# EAGLE design TimerControl-NewAccel (EAGLE 9.6.2)

## Sheet 1 of 2
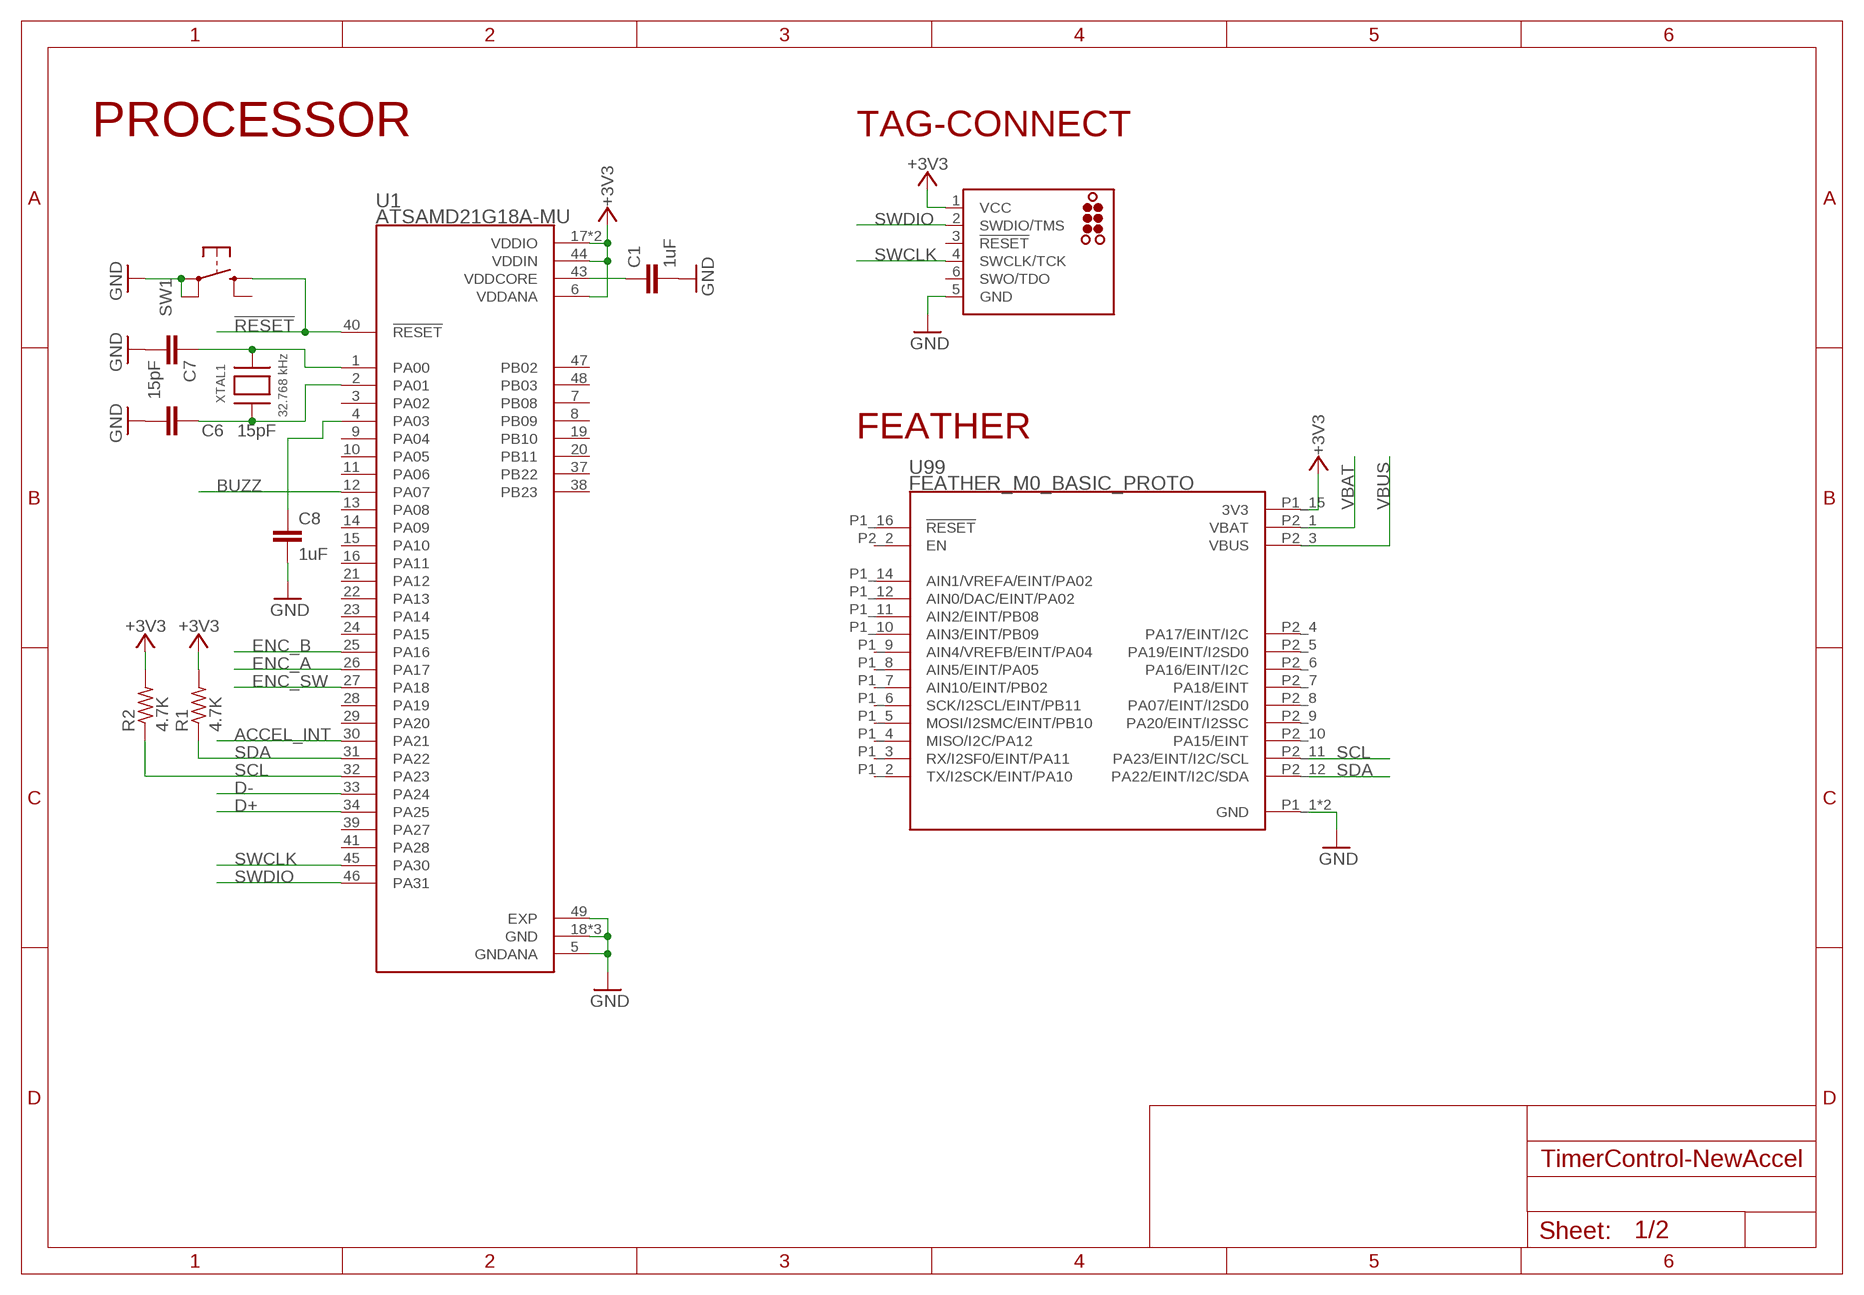
[diagram p0: schematic, sheet 1]

### Parts
C1  1uF  C-EUC0603  [C0603]
C6  15pF  C-EUC0603  [C0603]
C7  15pF  C-EUC0603  [C0603]
C8  1uF  C-EUC0603  [C0603]
J3  TC2030_SWD-MCP-NL  [TC2030-MCP-NL]
R1  4.7K  R-US_R0603  [R0603]
R2  4.7K  R-US_R0603  [R0603]
SW1  KMR2  4PIN_SMD_BUTTON  [2.80X4.60]
U1  ATSAMD21G18A-MU  [QFN50P700X700X90-49N]
U99  FEATHER_M0_BASIC_PROTO  [MODULE_FEATHER_M0_BASIC_PROTO]
XTAL1  32.768 kHz  XTAL  [XTAL3215]

### Nets
!RESET: SW1.B(S) U1.40(!RESET)
+3V3 [power]: J3.1(VCC) R1.2 R2.2 U1.6(VDDANA) U1.17(VDDIO) U1.36(VDDIO) U1.44(VDDIN) U99.P1_15(3V3) ; also sheet 2
ACCEL_INT: U1.30(PA21) ; also sheet 2
BUZZ: U1.12(PA07) ; also sheet 2
D+: U1.34(PA25) ; also sheet 2
D-: U1.33(PA24) ; also sheet 2
ENC_A: U1.26(PA17) ; also sheet 2
ENC_B: U1.25(PA16) ; also sheet 2
ENC_SW: U1.27(PA18) ; also sheet 2
GND: C1.2 C6.2 C7.2 C8.2 J3.5(GND) SW1.A'(P1) SW1.A(P) U1.5(GNDANA) U1.18(GND) U1.35(GND) U1.42(GND) U1.49(EXP) U99.P1_1(GND) U99.P1_13(GND) ; also sheet 2
N$1: C1.1 U1.43(VDDCORE)
N$3: C8.1 U1.4(PA03)
N$12: C6.1 U1.2(PA01) XTAL1.P$1
N$16: C7.1 U1.1(PA00) XTAL1.P$2
SCL: R2.1 U1.32(PA23) U99.P2_11(PA23/EINT/I2C/SCL) ; also sheet 2
SDA: R1.1 U1.31(PA22) U99.P2_12(PA22/EINT/I2C/SDA) ; also sheet 2
SWCLK: J3.4(SWCLK/TCK) U1.45(PA30)
SWDIO: J3.2(SWDIO/TMS) U1.46(PA31)
VBAT [power]: U99.P2_1(VBAT) ; also sheet 2
VBUS: U99.P2_3(VBUS) ; also sheet 2
Unconnected: J3.3(!RESET) J3.6(SWO/TDO) SW1.B'(S1) U1.3(PA02) U1.7(PB08) U1.8(PB09) U1.9(PA04) U1.10(PA05) U1.11(PA06) U1.13(PA08) U1.14(PA09) U1.15(PA10) U1.16(PA11) U1.19(PB10) U1.20(PB11) U1.21(PA12) U1.22(PA13) U1.23(PA14) U1.24(PA15) U1.28(PA19) U1.29(PA20) U1.37(PB22) U1.38(PB23) U1.39(PA27) U1.41(PA28) U1.47(PB02) U1.48(PB03) U99.P1_2(TX/I2SCK/EINT/PA10) U99.P1_3(RX/I2SF0/EINT/PA11) U99.P1_4(MISO/I2C/PA12) U99.P1_5(MOSI/I2SMC/EINT/PB10) U99.P1_6(SCK/I2SCL/EINT/PB11) U99.P1_7(AIN10/EINT/PB02) U99.P1_8(AIN5/EINT/PA05) U99.P1_9(AIN4/VREFB/EINT/PA04) U99.P1_10(AIN3/EINT/PB09) U99.P1_11(AIN2/EINT/PB08) U99.P1_12(AIN0/DAC/EINT/PA02) U99.P1_14(AIN1/VREFA/EINT/PA02) U99.P1_16(!RESET) U99.P2_2(EN) U99.P2_4(PA17/EINT/I2C) U99.P2_5(PA19/EINT/I2SD0) U99.P2_6(PA16/EINT/I2C) U99.P2_7(PA18/EINT) U99.P2_8(PA07/EINT/I2SD0) U99.P2_9(PA20/EINT/I2SSC) U99.P2_10(PA15/EINT)

### Notes on the sheet
- PROCESSOR | TAG-CONNECT
- FEATHER

## Sheet 2 of 2
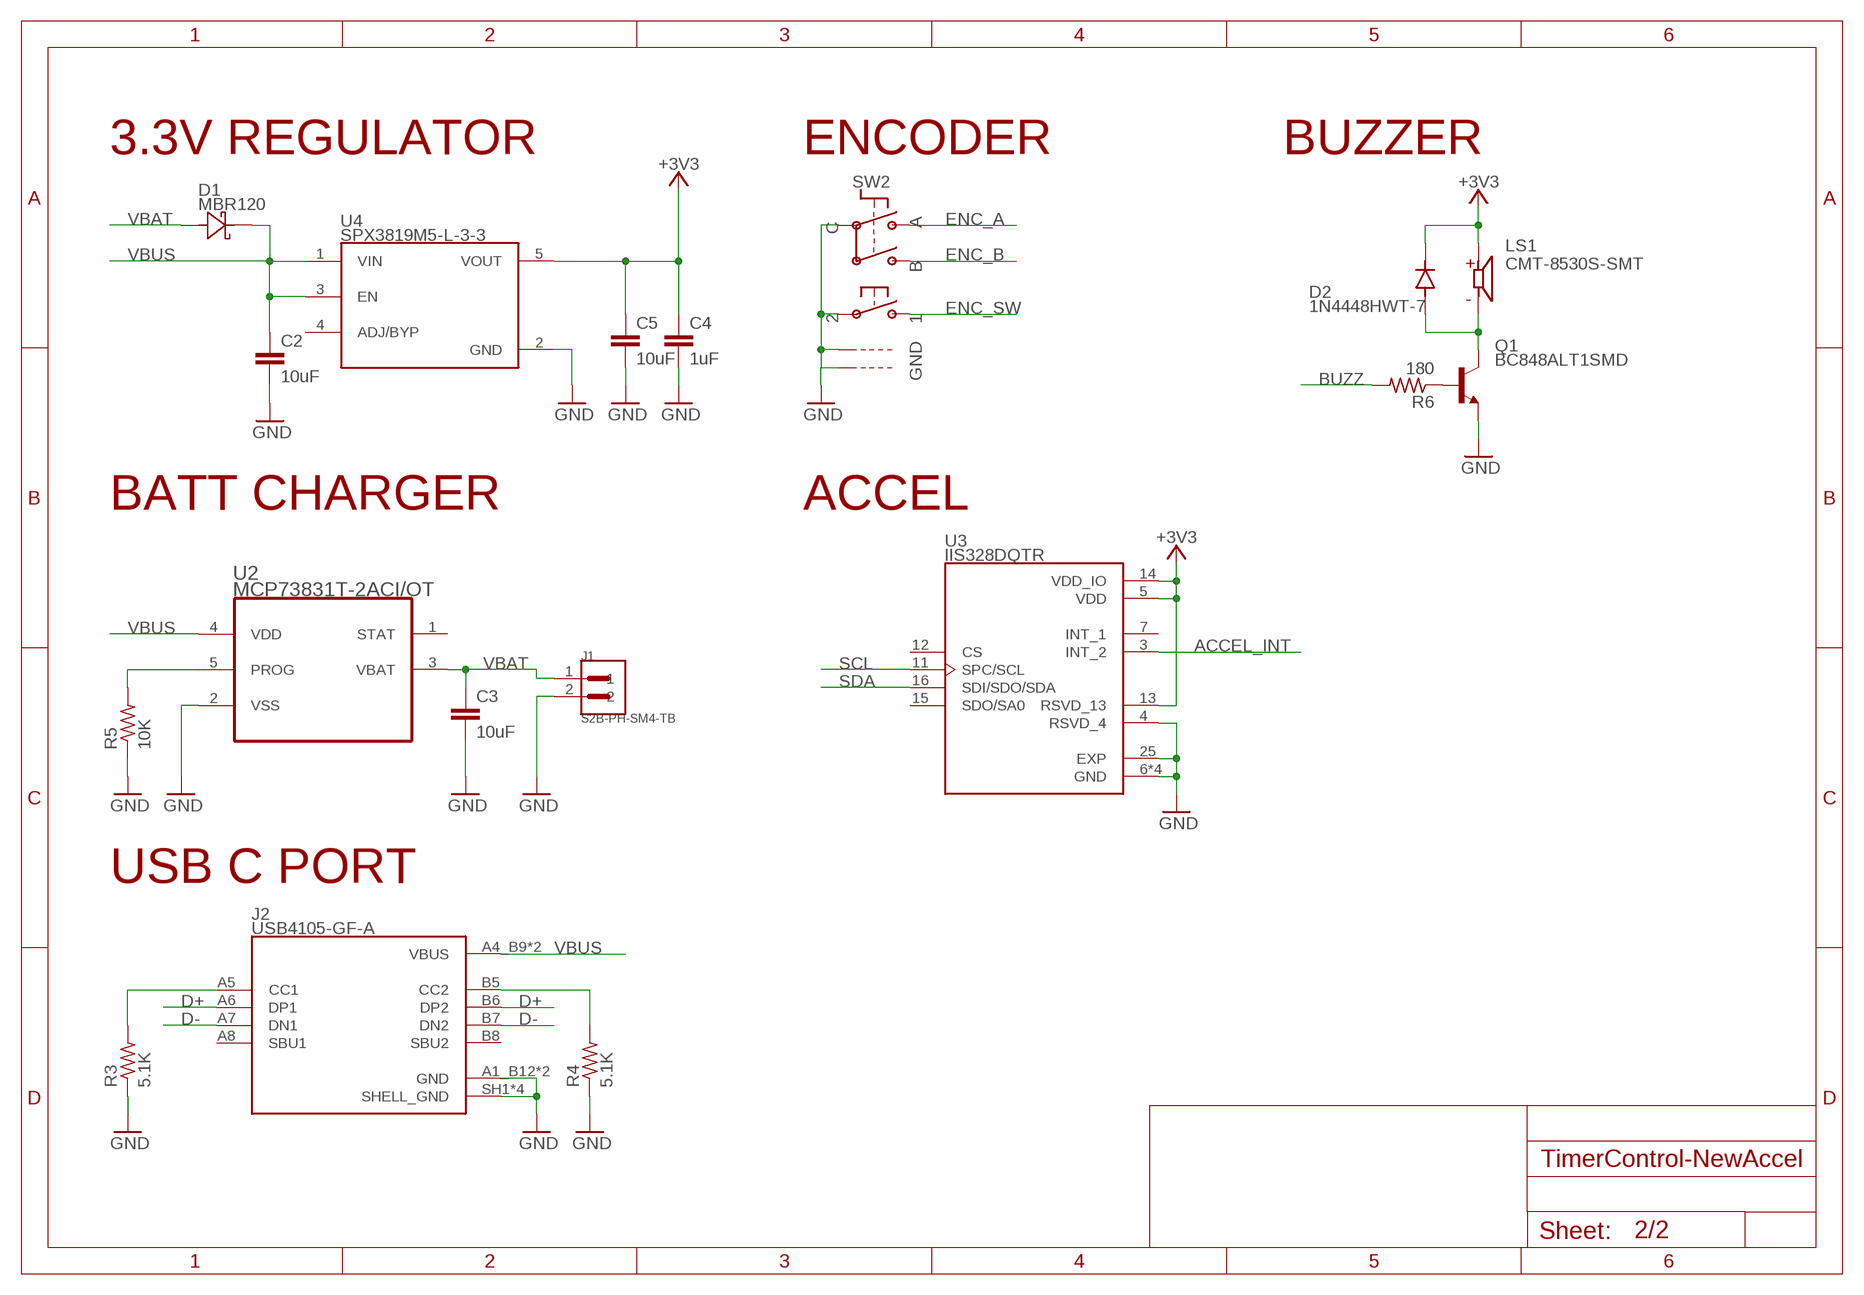
[diagram p1: schematic, sheet 2]

### Parts
C2  10uF  C-EUC0603  [C0603]
C3  10uF  C-EUC0603  [C0603]
C4  1uF  C-EUC0603  [C0603]
C5  10uF  C-EUC0603  [C0603]
D1  MBR120  [SOD−123FL]
D2  1N4448HWT-7  [SODFL1608X65N]
J1  S2B-PH-SM4-TB  [JST_S2B-PH-SM4-TB]
J2  USB4105-GF-A  [GCT_USB4105-GF-A]
LS1  CMT-8530S-SMT  [CUI_CMT-8530S-SMT]
Q1  BC848ALT1SMD  [SOT23]
R3  5.1K  R-US_R0603  [R0603]
R4  5.1K  R-US_R0603  [R0603]
R5  10K  R-US_R0603  [R0603]
R6  180  R-US_R0603  [R0603]
SW2  PEC11R_BOURNS_PEC11  [PEC11R]
U2  MCP73831T-2ACI/OT  [SOT95P280X145-5N]
U3  IIS328DQTR  [QFN50P400X400X185-25N]
U4  SPX3819M5-L-3-3  [SOT95P280X145-5N]

### Nets
+3V3 [power]: C4.1 C5.1 D2.C(K) LS1.P U3.5(VDD) U3.13(RSVD_13) U3.14(VDD_IO) U4.5(VOUT) ; also sheet 1
ACCEL_INT: U3.3(INT_2) ; also sheet 1
BUZZ: R6.2 ; also sheet 1
D+: J2.A6(DP1) J2.B6(DP2) ; also sheet 1
D-: J2.A7(DN1) J2.B7(DN2) ; also sheet 1
ENC_A: SW2.P$A ; also sheet 1
ENC_B: SW2.P$B ; also sheet 1
ENC_SW: SW2.P$1 ; also sheet 1
GND: C2.2 C3.2 C4.2 C5.2 J1.2 J2.A1_B12(GND) J2.B1_A12(GND) J2.SH1(SHELL_GND) J2.SH2(SHELL_GND) J2.SH3(SHELL_GND) J2.SH4(SHELL_GND) Q1.2(E) R3.1 R4.1 R5.1 SW2.P$2 SW2.P$C SW2.P$GND1 SW2.P$GND2 U2.2(VSS) U3.4(RSVD_4) U3.6(GND) U3.8(GND) U3.9(GND) U3.10(GND) U3.25(EXP) U4.2(GND) ; also sheet 1
N$2: R5.2 U2.5(PROG)
N$4: J2.B5(CC2) R4.2
N$5: D2.A LS1.N Q1.3(C)
N$6: Q1.1(B) R6.1
N$9: J2.A5(CC1) R3.2
SCL: U3.11(SPC/SCL) ; also sheet 1
SDA: U3.16(SDI/SDO/SDA) ; also sheet 1
VBAT [power]: C3.1 D1.A J1.1 U2.3(VBAT) ; also sheet 1
VBUS: C2.1 D1.C J2.A4_B9(VBUS) J2.B4_A9(VBUS) U2.4(VDD) U4.1(VIN) U4.3(EN) ; also sheet 1
Unconnected: J2.A8(SBU1) J2.B8(SBU2) U2.1(STAT) U3.7(INT_1) U3.12(CS) U3.15(SDO/SA0) U4.4(ADJ/BYP)

### Notes on the sheet
- 3.3V REGULATOR | ENCODER | BUZZER
- BATT CHARGER | ACCEL
- USB C PORT

## Library data of the parts
C1-C4 C6-C8 = rcl:C-EU: CAPACITOR, European symbol; SPICEPREFIX: C
C5 = rcl:C-EU: CAPACITOR, European symbol; REV: B; SPICEPREFIX: C
D1 = MBR120:MBR120
D2 = 1N4448HWT-7:1N4448HWT-7: 1N4448HWT Series 2 A 80 V 250 mW Surface Mount Fast Switching Diode - SOD-523 Check availability <https://pricing.snapeda.com/parts/1N4448HWT-7/Diodes%20Inc./view-part?ref=eda>; AVAILABILITY: In Stock; CHECK_PRICES: https://www.snapeda.com/parts/1N4448HWT-7/Diodes+Inc./view-part/?ref=eda; DESCRIPTION: Diode Switching 0.125A 80V SOD523 | Diodes Inc 1N4448HWT-7; MF: Diodes Inc.; MP: 1N4448HWT-7; PACKAGE: SOD-523 Diodes Inc.; PRICE: None; PURCHASE-URL: https://www.snapeda.com/api/url_track_click_mouser/?unipart_id=294207&manufacturer=Diodes Inc.&part_name=1N4448HWT-7&search_term=1n4448hwt-7; SNAPEDA_LINK: https://www.snapeda.com/parts/1N4448HWT-7/Diodes+Inc./view-part/?ref=snap
J1 = S2B-PH-SM4-TB:S2B-PH-SM4-TB: CONN HEADER PH SIDE 2POS 2MM SMD; MANUFACTURER: JST
J2 = USB4105-GF-A:USB4105-GF-A; MANUFACTURER: Global Connector Technology; MAXIMUM_PACKAGE_HEIGHT: 3.31mm; PARTREV: B3; STANDARD: Manufacturer Recommendations
J3 = Tag-Connect:TC2030_SWD: ARM20-CTX 20-Pin to TC2030-IDC Adapter for Cortex 6-Pin (TC2030-IDC family) </catalog/6> Cortex SWD </catalog/9> Adapters </adaptors> <javascript:void(0);> The Tag-Connect ARM20-CTX adapter board allows our TC2030-IDC cables to be used for ARM SWD (Single Wire Debug) applications. Although intended for use with our patented TC2030-IDC (and TC2030-IDC-NL) Plug-of-Nails™ Cables, the adapter may be useful to people wishing to use 6-pin 0.1” ribbon headers on their PCB instead of the traditional 20-Pin header. Please note the TC2030-IDC <http://tag-connect.com/TC2030-IDC> or TC2030-IDC-NL <http://tag-connect.com/TC2030-IDC-NL> cable is purchased separately, the cables and Segger JLINK seen in the pictures are not included! Download the Datasheet here. <http://www.tag-connect.com/Materials/ARM20-CTX.pdf>
LS1 = CMT-8530S-SMT:CMT-8530S-SMT: 8.5 mm, 3.6 Vo-p, 90 dB, Surface Mount (SMT), Magnetic Audio Transducer Buzzer; AVAILABILITY: Unavailable; DESCRIPTION: 8.5 mm, 3.6 Vo-p, 90 dB, Surface Mount _SMT_, Magnetic Audio Transducer Buzzer; MF: CUI; MP: CMT-8530S-SMT; PACKAGE: None; PRICE: None
Q1 = transistor-npn:BC848*: NPN Transistor
R1-R6 = rcl:R-US_: RESISTOR, American symbol; SPICEPREFIX: R
SW1 = SMD Button:4PIN_SMD_BUTTON
SW2 = PEC11R:PEC11R: Rotary Encoder with Built-In Switch PEC11 - 24 Step, PEC11-4215F-S24 - http://www.adafruit.com/products/377
U1 = ATSAMD21G18A-MU:ATSAMD21G18A-MU: Cortex-M0+, 256KB FLASH, 32KB SRAM, USB, DMA, T&R - 48QFN IND TEMP, GREEN, 1.6-3.6V, 48MHz/ QFN (ZA) Check availability <https://pricing.snapeda.com/parts/ATSAMD21G18A-MU/Microchip/view-part?ref=eda>; AVAILABILITY: In Stock; CHECK_PRICES: https://www.snapeda.com/parts/ATSAMD21G18A-MU/Microchip/view-part/?ref=eda; DESCRIPTION: ARM® Cortex®-M0+ SAM D21G, Functional Safety (FuSa) Microcontroller IC 32-Bit Single-Core 48MHz 256KB (256K x 8) FLASH 48-QFN (7x7); MF: Microchip; MP: ATSAMD21G18A-MU; PACKAGE: QFN-48 Microchip; PRICE: None; PURCHASE-URL: https://www.snapeda.com/api/url_track_click_mouser/?unipart_id=590181&manufacturer=Microchip&part_name=ATSAMD21G18A-MU&search_term=atsamd21g18a; SNAPEDA_LINK: https://www.snapeda.com/parts/ATSAMD21G18A-MU/Microchip/view-part/?ref=snap
U2 = MCP73831T-2ACI_OT:MCP73831T-2ACI/OT: Charge Management Controller; CHECK_PRICES: https://www.snapeda.com/parts/MCP73831T-2ACI/OT/Microchip/view-part/?ref=eda; DESCRIPTION: TINY INTEGRATED LI-ION/LI-POLY CHARGE MGNT CONTROLLER, 4.2V VREG | Microchip Technology Inc. MCP73831T-2ACI/OT; DIGIKEY_PART_NUMBER: MCP73831T-2ACI/OTTR-ND; MF: Microchip; MP: MCP73831T-2ACI/OT; PACKAGE: SOT-23 Microchip; PURCHASE-URL: https://www.snapeda.com/api/url_track_click_mouser/?unipart_id=53208&manufacturer=Microchip&part_name=MCP73831T-2ACI/OT&search_term=mcp73831; SNAPEDA_LINK: https://www.snapeda.com/parts/MCP73831T-2ACI/OT/Microchip/view-part/?ref=snap
U3 = IIS328DQTR:IIS328DQTR: Accelerometer Triple ±2g/±4g/±8g 3.3V 24-Pin QFN EP Tray; A_MAX: 1.85; B_MAX: 0.3; B_MIN: 0.2; B_NOM: 0.25; D2_NOM: 2.3; D_MAX: 4.0; D_MIN: 4.0; D_NOM: 4.0; E2_NOM: 2.3; ENOM: 0.5; E_MAX: 4.0; E_MIN: 4.0; E_NOM: 4.0; L_MAX: 0.45; L_MIN: 0.35; L_NOM: 0.4; MANUFACTURER: ST Microelectronics; MAXIMUM_PACKAGE_HEIGHT: 1.85mm; PARTREV: 3; PIN_COUNT_D: 6.0; PIN_COUNT_E: 6.0; STANDARD: IPC 7351B
U4 = SPX3819M5-L-3-3:SPX3819M5-L-3-3: 500mA, LOW-NOISE LDO VOLTAGE REGULATOR Check availability <https://pricing.snapeda.com/parts/SPX3819M5-L-3-3/MaxLinear/view-part?ref=eda>; AVAILABILITY: In Stock; DESCRIPTION: Linear Voltage Regulator IC Positive Fixed 1 Output 500mA SOT-23-5; MF: MaxLinear; MP: SPX3819M5-L-3-3; PACKAGE: SOT-23-5 MaxLinear; PRICE: None; PURCHASE-URL: https://pricing.snapeda.com/search/part/SPX3819M5-L-3-3/?ref=eda
U99 = FEATHER_M0_BASIC_PROTO:FEATHER_M0_BASIC_PROTO: ATSAMD21G18 Feather M0 Basic Proto SAM D ARM® Cortex®-M0+ MCU 32-Bit Embedded Evaluation Board Check availability <https://pricing.snapeda.com/parts/Feather%20M0%20Basic%20Proto/Adafruit%20Industries/view-part?ref=eda>; AVAILABILITY: Not in stock; CHECK_PRICES: https://www.snapeda.com/parts/Feather%20M0%20Basic%20Proto/Adafruit+Industries/view-part/?ref=eda; DESCRIPTION: ATSAMD21G18 Feather M0 Basic Proto series ARM® Cortex®-M0+ MCU 32-Bit Embedded Evaluation Board; MF: Adafruit Industries; MP: Feather M0 Basic Proto; PACKAGE: None; PRICE: None; SNAPEDA_LINK: https://www.snapeda.com/parts/Feather%20M0%20Basic%20Proto/Adafruit+Industries/view-part/?ref=snap
XTAL1 = XTAL:XTAL

## Net classes
1 power: width 0.102 mm

## Board
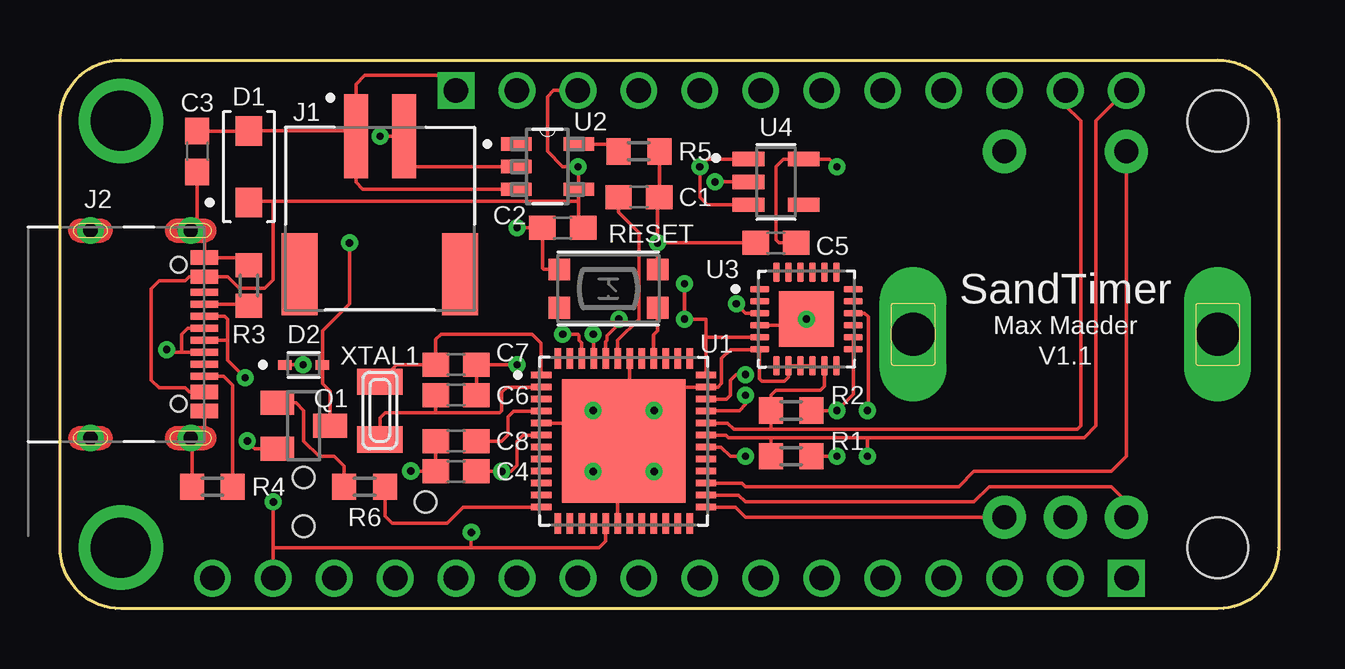
[diagram p2: board, top side]
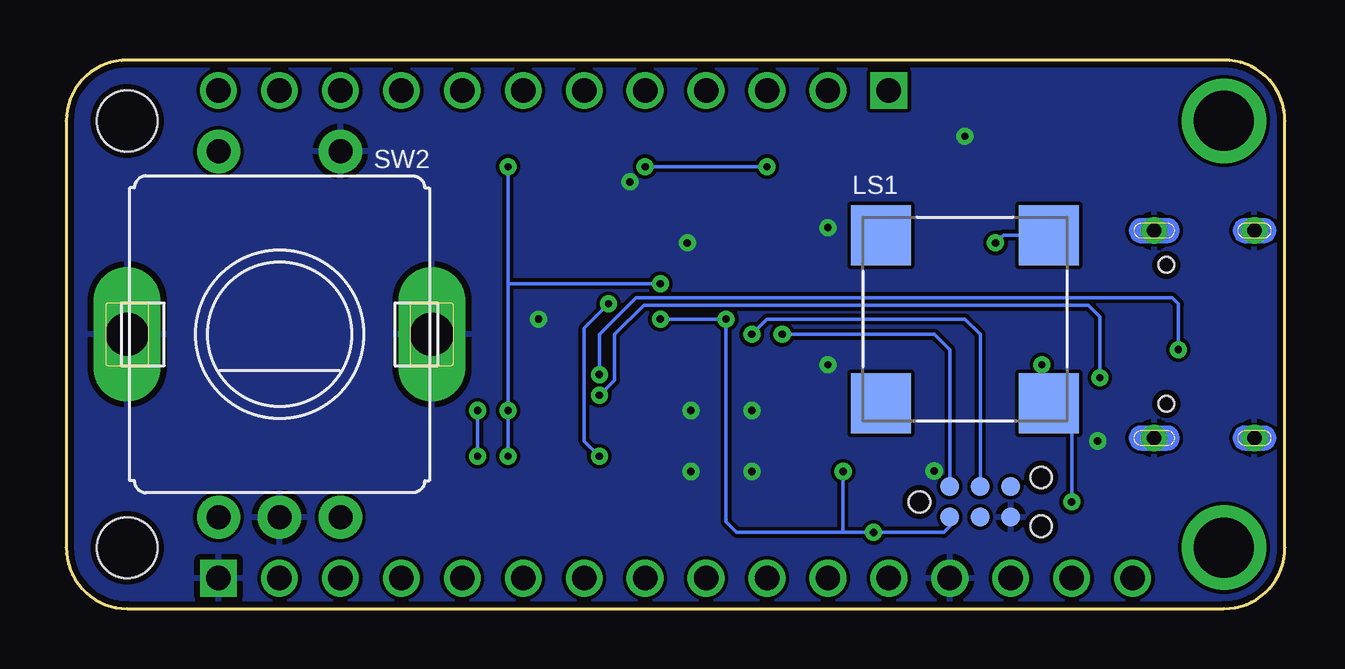
[diagram p3: board, bottom side, seen from below]

Size 50.8 x 22.86 mm. Coordinates in mm from the lower left corner, seen from the top.
Copper layers (1*16): Top 0.035mm / dielectric 1.5mm / Bottom 0.035mm
Design rules "default *": minimum track width 6mil, minimum drill 12mil, track to track 6mil, track to pad 6mil, pad to pad 6mil, via to via 6mil, smd to smd 6mil, copper to edge 10mil, drill to drill 6mil, minimum pad ring 10mil, minimum via ring 8mil, stop-mask expansion 2mil, vias tented up to drill 20mil, thermal gap 10mil

### Footprints (pad centres in the part's own frame; a part is rotated, then mirrored left to right if it is on the bottom)
C0603 = smd 1.1 x 1: 1 -0.85,0; 2 0.85,0
SOD−123FL = smd 1.24 x 1.12: A 1.49,0; C -1.49,0
SODFL1608X65N = smd 0.56 x 0.4: A 0.785,0; C -0.785,0
JST_S2B-PH-SM4-TB = smd 1 x 3.5: 1 1,0; 2 -1,0 | smd 1.5 x 3.4: P1 3.35,5.75; P2 -3.35,5.75
GCT_USB4105-GF-A = smd 0.6 x 1.15: A1_B12 -3.2,4.755; A4_B9 -2.4,4.755; B1_A12 3.2,4.755; B4_A9 2.4,4.755 | smd 0.3 x 1.15: A5 -1.25,4.755; A6 -0.25,4.755; A7 0.25,4.755; A8 1.25,4.755; B5 1.75,4.755; B6 0.75,4.755; B7 -0.75,4.755; B8 -1.75,4.755 | drill 0.6 pad 1: SH1 -4.32,4.18; SH2 4.32,4.18; SH3 -4.32,0; SH4 4.32,0 | hole 0.65: 2.89,3.68; -2.89,3.68
TC2030-MCP-NL = smd 0.787 x 0.787: 1 1.27,-0.635; 2 1.27,0.635; 3 2.54,-0.635; 4 2.54,0.635; 5 3.81,-0.635; 6 3.81,0.635 | hole 0.889: 0,0; 5.08,-1.016; 5.08,1.016
CUI_CMT-8530S-SMT = smd 2.5 x 2.5: 1 -3.5,3.5; 2 -3.5,-3.5; N 3.5,3.5; P 3.5,-3.5
SOT23 = smd 1 x 1.4: 1 -0.95,-1.1; 2 0.95,-1.1; 3 0,1.1
R0603 = smd 1 x 1.1: 1 -0.85,0; 2 0.85,0
2.80X4.60 = smd 0.9 x 0.9: A 2.05,0.8; A' -2.05,0.8; B 2.05,-0.8; B' -2.05,-0.8
PEC11R = drill 1 pad 1.8: P$1 -2.54,7.62; P$2 2.54,7.62; P$A -2.54,-7.62; P$B 2.54,-7.62; P$C 0,-7.62 | drill 1.8 pad 2.8 long: P$GND1 -6.35,0; P$GND2 6.35,0
QFN50P700X700X90-49N = smd 0.84 x 0.26: 1 -3.435,2.75; 2 -3.435,2.25; 3 -3.435,1.75; 4 -3.435,1.25; 5 -3.435,0.75; 6 -3.435,0.25; 7 -3.435,-0.25; 8 -3.435,-0.75; 9 -3.435,-1.25; 10 -3.435,-1.75; 11 -3.435,-2.25; 12 -3.435,-2.75; 25 3.435,-2.75; 26 3.435,-2.25; 27 3.435,-1.75; 28 3.435,-1.25; 29 3.435,-0.75; 30 3.435,-0.25; 31 3.435,0.25; 32 3.435,0.75; 33 3.435,1.25; 34 3.435,1.75; 35 3.435,2.25; 36 3.435,2.75 | smd 0.26 x 0.84: 13 -2.75,-3.435; 14 -2.25,-3.435; 15 -1.75,-3.435; 16 -1.25,-3.435; 17 -0.75,-3.435; 18 -0.25,-3.435; 19 0.25,-3.435; 20 0.75,-3.435; 21 1.25,-3.435; 22 1.75,-3.435; 23 2.25,-3.435; 24 2.75,-3.435; 37 2.75,3.435; 38 2.25,3.435; 39 1.75,3.435; 40 1.25,3.435; 41 0.75,3.435; 42 0.25,3.435; 43 -0.25,3.435; 44 -0.75,3.435; 45 -1.25,3.435; 46 -1.75,3.435; 47 -2.25,3.435; 48 -2.75,3.435 | smd 5.15 x 5.15: 49 0,0
SOT95P280X145-5N = smd 1.27 x 0.559: 1 -1.295,0.94; 2 -1.295,0; 3 -1.295,-0.94; 4 1.295,-0.94; 5 1.295,0.94
QFN50P400X400X185-25N = smd 0.81 x 0.27: 1 -1.95,1.25; 2 -1.95,0.75; 3 -1.95,0.25; 4 -1.95,-0.25; 5 -1.95,-0.75; 6 -1.95,-1.25; 13 1.95,-1.25; 14 1.95,-0.75; 15 1.95,-0.25; 16 1.95,0.25; 17 1.95,0.75; 18 1.95,1.25 | smd 0.27 x 0.81: 7 -1.25,-1.95; 8 -0.75,-1.95; 9 -0.25,-1.95; 10 0.25,-1.95; 11 0.75,-1.95; 12 1.25,-1.95; 19 1.25,1.95; 20 0.75,1.95; 21 0.25,1.95; 22 -0.25,1.95; 23 -0.75,1.95; 24 -1.25,1.95 | smd 2.3 x 2.3: 25 0,0
SOT95P280X145-5N' = smd 1.32 x 0.6: 1 -1.15,0.95; 2 -1.15,0; 3 -1.15,-0.95; 4 1.15,-0.95; 5 1.15,0.95
MODULE_FEATHER_M0_BASIC_PROTO = drill 1.02 square: P1_1 19.05,-10.16; P2_1 -8.89,10.16 | drill 1.02: P1_2 16.51,-10.16; P1_3 13.97,-10.16; P1_4 11.43,-10.16; P1_5 8.89,-10.16; P1_6 6.35,-10.16; P1_7 3.81,-10.16; P1_8 1.27,-10.16; P1_9 -1.27,-10.16; P1_10 -3.81,-10.16; P1_11 -6.35,-10.16; P1_12 -8.89,-10.16; P1_13 -11.43,-10.16; P1_14 -13.97,-10.16; P1_15 -16.51,-10.16; P1_16 -19.05,-10.16; P2_2 -6.35,10.16; P2_3 -3.81,10.16; P2_4 -1.27,10.16; P2_5 1.27,10.16; P2_6 3.81,10.16; P2_7 6.35,10.16; P2_8 8.89,10.16; P2_9 11.43,10.16; P2_10 13.97,10.16; P2_11 16.51,10.16; P2_12 19.05,10.16 | drill 2.5 pad 3.2: P$1 -22.86,8.89; P$2 -22.86,-8.89 | hole 2.54: 22.86,-8.89; 22.86,8.89
XTAL3215 = smd 1.1 x 1.9: P$1 1.2,0; P$2 -1.2,0

### Placement (x,y rotation side)
C1  24.13,17.14 0 top
C2  20.95,15.88 180 top
C3  5.71,19.05 270 top
C4  16.51,5.71 180 top
C5  29.84,15.24 180 top
C6  16.51,8.89 0 top
C7  16.51,10.16 0 top
C8  16.51,6.99 180 top
D1  7.87,18.41 90 top
D2  10.16,10.16 0 top
J1  13.34,19.68 180 top
J2  1.27,11.43 270 top
J3  15.24,4.45 0 bottom
LS1  13.34,12.06 0 bottom
Q1  10.16,7.62 270 top
R1  30.48,6.35 0 top
R2  30.48,8.26 0 top
R3  7.87,13.46 270 top
R4  6.35,5.08 0 top
R5  24.13,19.05 180 top
R6  12.7,5.08 0 top
SW1  22.86,13.34 0 top
SW2  41.91,11.43 0 bottom
U1  23.5,6.99 0 top
U2  20.32,18.41 0 top
U3  31.11,12.06 0 top
U4  SPX3819M5-L-3-3  [SOT95P280X145-5N']  29.84,17.78 0 top
U99  25.4,11.43 0 top
XTAL1  13.34,8.26 270 top

### Tracks (layer width: path | path; a pad name or v marks a point on that pad's centre or on a via)
!RESET
  Top 0.152: U1.40 24.75,11.41 24.91,11.57 SW1.B
+3V3  (via drill 0.3)
  Top 0.152: 26.93,11.31 26.93,12.06 v26.04,12.06 v26.04,13.54 | 26.93,11.31 U1.36 | U1.6 19.3,7.24 19.05,6.99 19.05,5.97 18.8,5.71 v18.41,5.71 C4.1 | U1.17 22.75,2.81 22.48,2.54 17.14,2.54 | U99.P1_15 8.89,2.54 | 17.14,2.54 v17.14,3.17 | U1.44 22.75,11.12 22.81,11.19 22.81,11.38 23.3,11.87 v23.3,12.06 | C5.1 29.97,15.24 29.84,15.37 29.84,18.41 30.16,18.73 U4.5 32.07,18.73 v32.38,18.41 | R1.2 v32.38,6.35 | R2.2 v32.38,8.26 33.06,8.94 U3.13 U3.14 | D2.C v10.13,10.16 | 8.89,2.54 v8.89,4.45 | 17.14,2.54 8.89,2.54 | U3.5 26.93,11.31
  Bottom 0.152: J3.1 13.97,3.43 14.22,3.17 v17.14,3.17 18.41,3.17 | 18.41,3.17 22.86,3.17 23.3,3.61 v23.3,12.06 v26.04,12.06 | v32.38,6.35 v32.38,8.26 32.38,13.54 | v32.38,18.41 32.38,13.56 32.38,13.54 | v10.13,10.16 10.13,8.86 9.84,8.57 | 9.84,8.57 LS1.P | 18.41,3.17 v18.41,5.71 | v8.89,4.45 8.89,8.57 9.84,8.57 | v26.04,13.54 32.38,13.54
ACCEL_INT  (via drill 0.3)
  Top 0.152: U1.30 27.55,6.74 27.94,6.35 v28.57,6.35 | U3.3 28.58,12.31 v28.19,12.7
  Bottom 0.152: v28.57,6.35 29.21,6.99 29.21,11.68 v28.19,12.7
BUZZ
  Top 0.152: U1.12 16.81,4.24 16.13,3.56 13.84,3.56 13.55,3.85 R6.2
D+  (via drill 0.3)
  Top 0.152: J2.B6 5.08,10.68 | 5.08,10.68 4.56,10.68 v4.45,10.79 | J2.A6 5.33,11.68 5.08,11.43 5.08,10.68 | v28.57,9.75 28.17,9.75 27.94,9.53 27.94,8.89 27.79,8.73 U1.34
  Bottom 0.152: v4.45,10.79 4.45,12.7 4.7,12.95 27.05,12.95 28.57,11.43 v28.57,9.75
D-  (via drill 0.3)
  Top 0.152: J2.A7 6.99,11.18 | J2.B7 6.87,12.18 6.99,12.06 6.99,11.18 | 6.99,11.18 6.99,10.35 v7.72,9.62 | U1.33 26.95,8.26 28.32,8.26 28.57,8.51 v28.57,8.89
  Bottom 0.152: v7.72,9.62 7.72,12.16 8.2,12.65 26.72,12.65 27.94,11.43 27.94,9.53 v28.57,8.89
ENC_A
  Top 0.152: U1.26 28.29,4.74 28.57,4.45 38.1,4.45 38.73,5.08 43.81,5.08 44.45,4.45 SW2.P$A
ENC_B
  Top 0.152: SW2.P$B 28.57,3.81 28.15,4.24 U1.25
ENC_SW
  Top 0.152: U1.27 28.42,5.24 28.57,5.08 37.47,5.08 38.1,5.71 43.81,5.71 44.45,6.35 SW2.P$1
GND  (via drill 0.3)
  Top 0.152: R3.1 7.56,14.63 J2.A1_B12 6.03,15.75 J2.SH1 5.71,16.02 C3.2 | J2.B1_A12 6.03,7.11 J2.SH2 5.5,7.11 R4.1 | U1.5 22.75,7.74 U1.49 | U1.42 23.75,7.24 U1.49 | U1.18 23.25,6.74 U1.49 | U1.49 v24.77,8.26 25.75,9.23 U1.35 27.43,9.23 27.58,9.38 27.58,10.43 27.94,10.79 29.14,10.79 U3.6 29.16,9.57 29.25,9.48 30.2,9.48 30.36,9.64 U3.8 U3.9 U3.10 | SW1.A v24.91,15.24 | v24.91,15.24 24.91,17.07 C1.2 R5.1 | SW1.A' 20.16,14.13 20.11,14.19 C2.2 v19.05,15.88 | U4.2 v27.3,17.78 | C5.2 v24.91,15.24 | v13.34,19.68 J1.2 14.34,18.68 14.61,18.41 U2.2 | 17.78,10.16 C7.2 | C7.2 C6.2 | C7.2 v19.05,10.16 | C8.2 C4.2 15.64,5.73 v14.62,5.73 | Q1.2 8.12,6.67 v7.81,6.99 | 31.36,11.81 U3.25 | 30.36,11.31 U3.25 | U3.4 30.86,11.81 U3.25
  other vias: 22.23,8.26 24.77,5.71 22.23,5.71 31.11,12.06
  pour Bottom: -1.27,24.13 52.07,24.13 52.07,-1.27 -1.27,-1.27
N$1
  Top 0.152: U1.43 23.25,11.18 24.13,12.06 24.13,15.66 23.28,16.51 C1.1
N$2
  Top 0.152: U2.5 22.98,19.36 R5.2
N$3
  Top 0.152: U1.4 18.9,8.23 18.67,8 18.67,7.24 18.41,6.99 C8.1
N$4
  Top 0.152: R4.2 7.2,9.31 6.83,9.68 J2.B5
N$5  (via drill 0.3)
  Top 0.152: v12.06,15.24 12.06,12.7 10.95,11.58 D2.A 10.95,9.38 11.26,9.06 Q1.3
  Bottom 0.152: LS1.N 11.74,15.56 v12.06,15.24
N$6
  Top 0.152: R6.1 11.85,5.93 11.43,6.35 10.79,6.35 10.16,6.99 10.16,8.26 9.85,8.57 Q1.1
N$9
  Top 0.152: J2.A5 7.81,12.68 R3.2
N$12
  Top 0.152: XTAL1.P$1 13.34,7.94 13.55,8.16 15.24,8.16 15.66,8.16 | U1.2 18.63,9.23 18.41,9.02 18.41,8.26 18.32,8.16 15.66,8.16 | C6.1 15.66,8.16
N$16
  Top 0.152: XTAL1.P$2 14.04,10.16 C7.1 15.66,11.21 15.88,11.43 19.68,11.43 20.06,11.05 U1.1
SCL
  Top 0.152: U99.P2_11 41.91,20.95 42.55,20.32 42.55,7.62 42.4,7.48 29.63,7.48 | U1.32 27.82,7.74 28.08,7.48 29.63,7.48 | 29.63,7.48 R2.1 29.63,8.88 29.84,9.1 31.71,9.1 31.86,9.26 U3.11
SDA  (via drill 0.3)
  Top 0.152: U99.P2_12 43.18,20.32 43.18,7.62 42.69,7.13 33.66,7.13 | 33.66,7.13 29.63,7.13 | 29.63,7.13 27.87,7.13 27.76,7.24 U1.31 | R1.1 29.63,7.13 | v33.66,8.26 33.7,8.3 33.7,12.15 33.54,12.31 U3.16 | v33.66,6.35 33.66,7.13
  Bottom 0.152: v33.66,8.26 v33.66,6.35
SWCLK  (via drill 0.3)
  Top 0.152: v22.23,11.43 22.25,11.41 U1.45
  Bottom 0.152: v22.23,11.43 21.59,12.06 13.34,12.06 12.7,11.43 J3.4
SWDIO  (via drill 0.3)
  Top 0.152: U1.46 21.75,11.08 21.64,11.19 21.64,11.38 21.59,11.43 v20.95,11.43
  Bottom 0.152: v20.95,11.43 14.61,11.43 13.97,10.79 J3.2
VBAT
  Top 0.152: C3.1 D1.A 12.12,19.91 J1.1 | U99.P2_1 16.51,22.23 12.7,22.23 12.34,21.86 J1.1 | U2.3 12.62,17.48 12.34,17.76 J1.1
VBUS  (via drill 0.3)
  Top 0.152: 8.89,16.97 8.89,13.7 8.53,13.34 7.47,13.34 6.98,13.83 J2.A4_B9 5.39,13.83 5.22,13.66 4.14,13.66 3.81,13.34 3.81,9.53 4.14,9.2 5.22,9.2 5.39,9.03 J2.B4_A9 | C2.1 21.61,16.07 21.61,16.97 | 21.61,16.97 U2.4 21.61,18.39 v21.59,18.41 20.95,18.41 20.32,19.05 20.32,21.34 20.57,21.59 U99.P2_3 | U4.1 26.98,18.73 v26.67,18.41 26.67,17.14 26.98,16.83 U4.3 | 21.61,16.97 8.89,16.97 | 8.89,16.97 7.87,16.97 D1.C
  Bottom 0.152: v21.59,18.41 v26.67,18.41

### Text on the board
tNames: RESET | SandTimer | Max Maeder | V1.1